# EAGLE design IRAMX-drv-v3 (EAGLE 7.2.0)
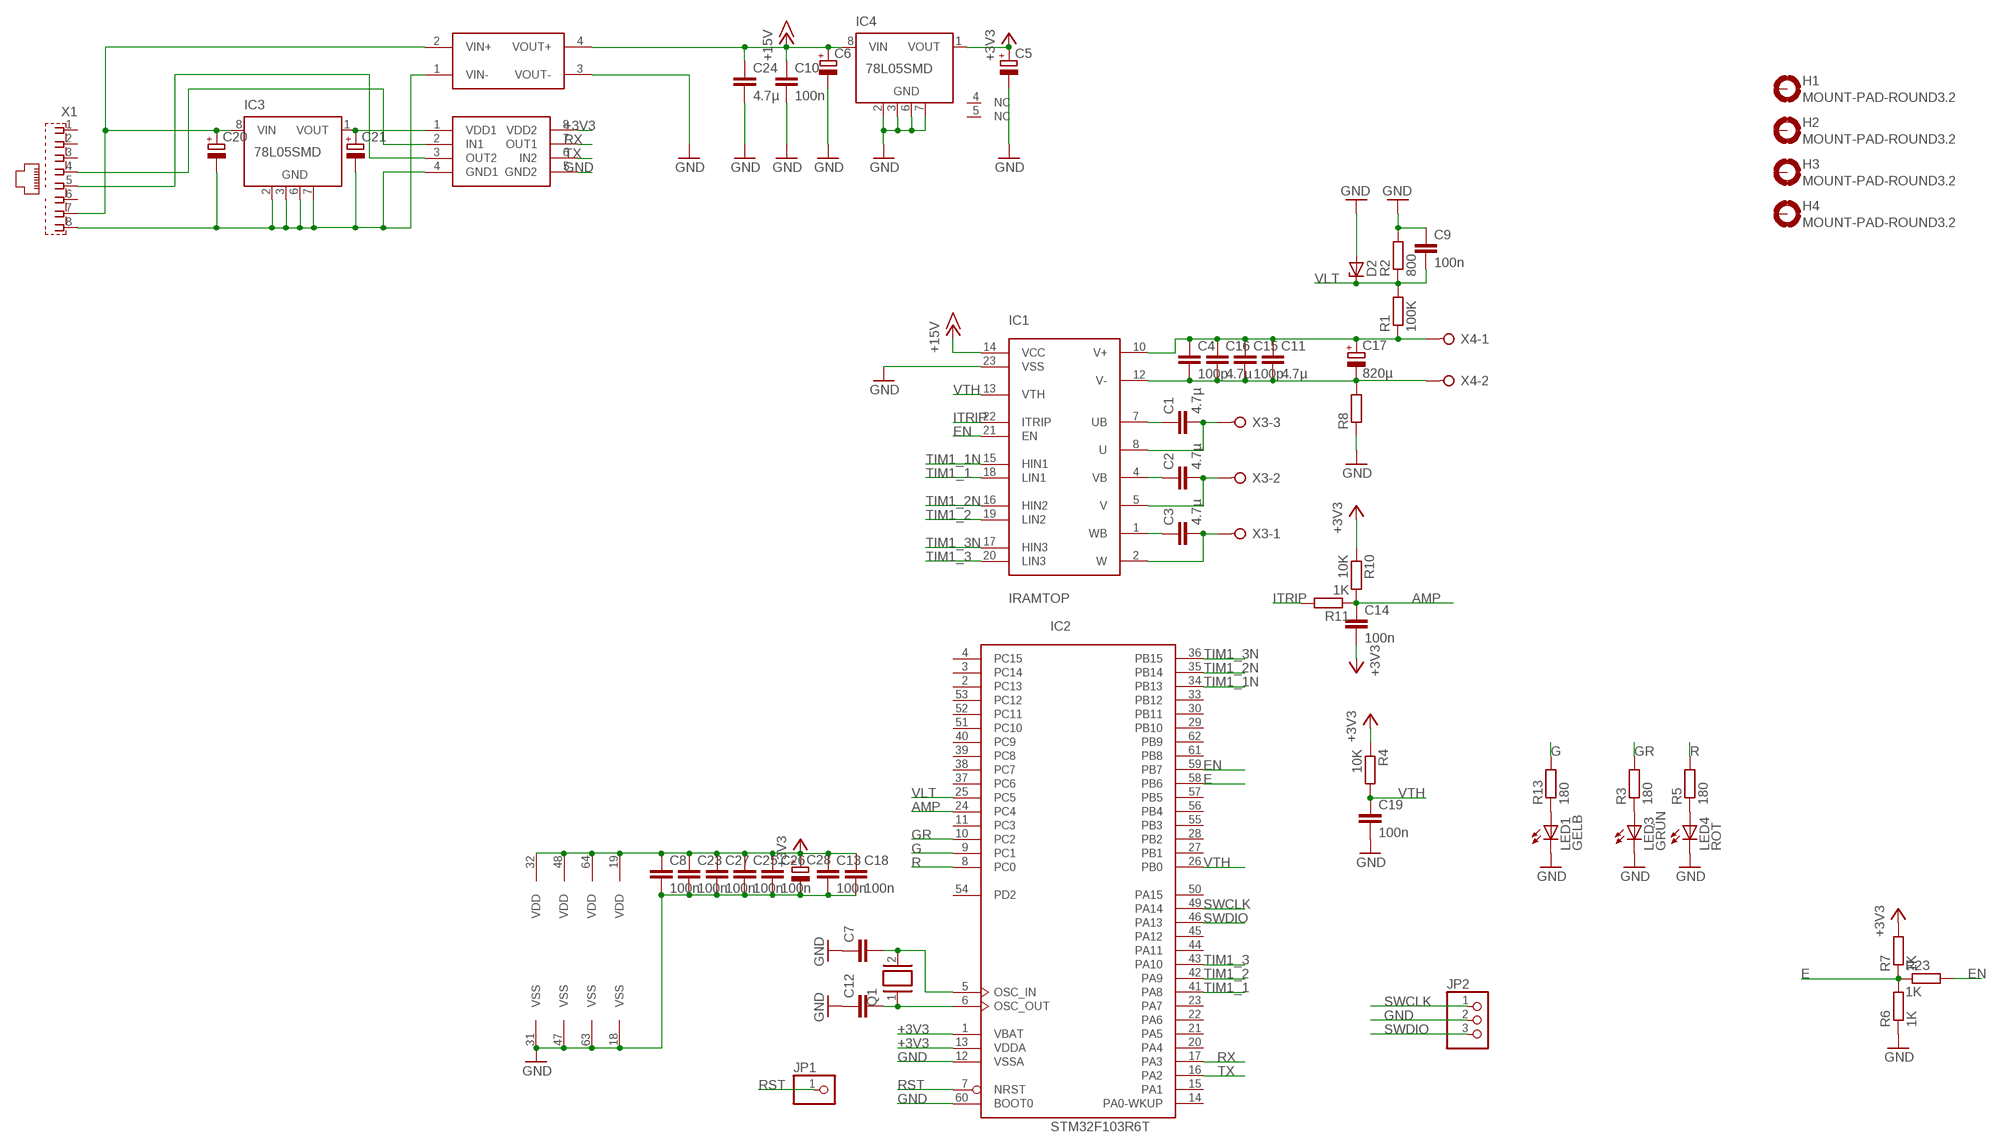
[diagram p0: schematic, sheet 1]

## Parts
C1  4.7µ  C-EUC0805K  [C0805K]
C2  4.7µ  C-EUC0805K  [C0805K]
C3  4.7µ  C-EUC0805K  [C0805K]
C4  100p  C-EUC1206K  [C1206K]
C5  CPOL-EUA/3216-18R  [A/3216-18R]
C6  CPOL-EUA/3216-18R  [A/3216-18R]
C7  C-EUC0805  [C0805]
C8  100n  C-EUC0805K  [C0805K]
C9  100n  C-EUC0805K  [C0805K]
C10  100n  C-EUC0805K  [C0805K]
C11  4.7µ  C-EUC0805K  [C0805K]
C12  C-EUC0805  [C0805]
C13  100n  C-EUC0805K  [C0805K]
C14  100n  C-EUC0805K  [C0805K]
C15  100p  C-EUC1206K  [C1206K]
C16  4.7µ  C-EUC0805K  [C0805K]
C17  820µ  CPOL-EUE10-35  [EB35D]
C18  100n  C-EUC0805K  [C0805K]
C19  100n  C-EUC0805K  [C0805K]
C20  CPOL-EUA/3216-18R  [A/3216-18R]
C21  CPOL-EUA/3216-18R  [A/3216-18R]
C23  100n  C-EUC0805K  [C0805K]
C24  4.7µ  C-EUC0805K  [C0805K]
C25  100n  C-EUC0805K  [C0805K]
C26  100n  C-EUC0805K  [C0805K]
C27  100n  C-EUC0805K  [C0805K]
C28  CPOL-EUA/3216-18R  [A/3216-18R]
D2  ZENER-DIODESOD80C  [SOD80C]
H1  MOUNT-PAD-ROUND3.2  [3,2-PAD]
H2  MOUNT-PAD-ROUND3.2  [3,2-PAD]
H3  MOUNT-PAD-ROUND3.2  [3,2-PAD]
H4  MOUNT-PAD-ROUND3.2  [3,2-PAD]
IC1  IRAMTOP  [SIP23_TOP]
IC2  STM32F103R6T  [LQFP64]
IC3  78L05SMD  [SO08]
IC4  78L05SMD  [SO08]
JP1  PINHD-1X1  [1X01]
JP2  PINHD-1X3  [1X03]
LED1  GELB  LED3MM  [LED3MM]
LED3  GRÜN  LED3MM  [LED3MM]
LED4  ROT  LED3MM  [LED3MM]
Q1  XTAL/S  [QS]
R1  100K  R-EU_R0805  [R0805]
R2  800  R-EU_R0805  [R0805]
R3  180  R-EU_R0805  [R0805]
R4  10K  R-EU_R0805  [R0805]
R5  180  R-EU_R0805  [R0805]
R6  1K  R-EU_R0805  [R0805]
R7  1K  R-EU_R0805  [R0805]
R8  R-EU_R0805  [R0805]
R10  10K  R-EU_R0805  [R0805]
R11  1K  R-EU_R0805  [R0805]
R13  180  R-EU_R0805  [R0805]
R23  1K  R-EU_R0805  [R0805]
U$1  SI8621  [SOIC08]
U$2  RO-XXXX  [SIP4]
X1  RJ45  [RJ45]
X3  W237-03P  [W237-133]
X4  W237-02P  [W237-132]

## Nets
+3V3: C5.+ C8.1 C13.1 C14.2 C18.1 C23.1 C25.1 C26.1 C27.1 C28.+ IC2.1(VBAT) IC2.13(VDDA) IC2.19(VDD) IC2.32(VDD) IC2.48(VDD) IC2.64(VDD) IC4.1(VOUT) R4.1 R7.2 R10.1 U$1.8(VDD2)
+15V: C6.+ C10.1 C24.1 IC1.14(VCC) IC4.8(VIN) U$2.4(VOUT+)
AMP: C14.1 IC2.24(PC4) R10.2 R11.1
E: IC2.58(PB6) R6.2 R7.1 R23.1
EN: IC1.21(EN) IC2.59(PB7) R23.2
G: IC2.9(PC1) R13.2
GND: C5.- C6.- C7.1 C8.2 C9.1 C10.2 C12.1 C13.2 C18.2 C19.2 C23.2 C24.2 C25.2 C26.2 C27.2 C28.- D2.A IC1.23(VSS) IC2.12(VSSA) IC2.18(VSS) IC2.31(VSS) IC2.47(VSS) IC2.60(BOOT0) IC2.63(VSS) IC4.2(GND) IC4.3(GND) IC4.6(GND) IC4.7(GND) JP2.2 LED1.K(C) LED3.K(C) LED4.K(C) R2.2 R6.1 R8.1 U$1.5(GND2) U$2.3(VOUT-)
GR: IC2.10(PC2) R3.2
ISO_GND: C20.- C21.- IC3.2(GND) IC3.3(GND) IC3.6(GND) IC3.7(GND) U$1.4(GND1) U$2.1(VIN-) X1.8
ITRIP: IC1.22(ITRIP) R11.2
N$1 [iso]: C1.1 IC1.7(UB)
N$3 [iso]: C2.1 IC1.4(VB)
N$5 [iso]: C3.1 IC1.1(WB)
N$8: LED3.A R3.1
N$9: LED4.A R5.1
N$10: C7.2 IC2.5(OSC_IN) Q1.2
N$11: C21.+ IC3.1(VOUT) U$1.1(VDD1)
N$12: C12.2 IC2.6(OSC_OUT) Q1.1
N$13: U$1.2(IN1) X1.4
N$14: U$1.3(OUT2) X1.5
N$17: C20.+ IC3.8(VIN) U$2.2(VIN+) X1.7
N$43: LED1.A R13.1
R: IC2.8(PC0) R5.2
RST: IC2.7(NRST) JP1.1
RX: IC2.17(PA3) U$1.7(OUT1)
SWCLK: IC2.49(PA14) JP2.1
SWDIO: IC2.46(PA13) JP2.3
TIM1_1: IC1.18(LIN1) IC2.41(PA8)
TIM1_1N: IC1.15(HIN1) IC2.34(PB13)
TIM1_2: IC1.19(LIN2) IC2.42(PA9)
TIM1_2N: IC1.16(HIN2) IC2.35(PB14)
TIM1_3: IC1.20(LIN3) IC2.43(PA10)
TIM1_3N: IC1.17(HIN3) IC2.36(PB15)
TX: IC2.16(PA2) U$1.6(IN2)
U [dick]: C1.2 IC1.8(U) X3.3
V [dick]: C2.2 IC1.5(V) X3.2
V+ [dick]: C4.1 C11.1 C15.1 C16.1 C17.+ IC1.10(V+) R1.1 X4.1
V-: C4.2 C11.2 C15.2 C16.2 C17.- IC1.12(V-) R8.2 X4.2
VLT: C9.2 D2.C IC2.25(PC5) R1.2 R2.1
VTH: C19.1 IC1.13(VTH) IC2.26(PB0) R4.2
W [dick]: C3.2 IC1.2(W) X3.1
Unconnected: H1.B3,2(MOUNT) H2.B3,2(MOUNT) H3.B3,2(MOUNT) H4.B3,2(MOUNT) IC2.2(PC13) IC2.3(PC14) IC2.4(PC15) IC2.11(PC3) IC2.14(PA0-WKUP) IC2.15(PA1) IC2.20(PA4) IC2.21(PA5) IC2.22(PA6) IC2.23(PA7) IC2.27(PB1) IC2.28(PB2) IC2.29(PB10) IC2.30(PB11) IC2.33(PB12) IC2.37(PC6) IC2.38(PC7) IC2.39(PC8) IC2.40(PC9) IC2.44(PA11) IC2.45(PA12) IC2.50(PA15) IC2.51(PC10) IC2.52(PC11) IC2.53(PC12) IC2.54(PD2) IC2.55(PB3) IC2.56(PB4) IC2.57(PB5) IC2.61(PB8) IC2.62(PB9) IC3.4(NC) IC3.5(NC) IC4.4(NC) IC4.5(NC) X1.1 X1.2 X1.3 X1.6

## Library data of the parts
C1-C4 C7-C16 C18 C19 C23-C27 = rcl:C-EU: CAPACITOR, European symbol
C5 C6 C17 C20 C21 C28 = rcl:CPOL-EU: POLARIZED CAPACITOR, European symbol
D2 = diode:ZENER-DIODE: Z-Diode
H1-H4 = holes:MOUNT-PAD-ROUND: MOUNTING PAD, round
IC1 = iram-b:IRAM
IC2 = micro-stm_v2:STM32F103R*T: ARM 32-bit Cortex™-M3 CPU 72 MHz maximum frequency 16 to 1024 Kbytes of Flash memory 6 to 96 kbytes of SRAM 51 GPIOs 2.0 to 3.6 V application supply
IC3 IC4 = linear:78L*SMD: Positive VOLTAGE REGULATOR
JP1 = pinhead:PINHD-1X1: PIN HEADER
JP2 = pinhead:PINHD-1X3: PIN HEADER
LED1 LED3 LED4 = led:LED: LED OSRAM: - CHIPLED LG R971, LG N971, LY N971, LG Q971, LY Q971, LO R971, LY R971 LH N974, LH R974 LS Q976, LO Q976, LY Q976 LO Q996 - Hyper CHIPLED LW Q18S LB Q993, LB Q99A, LB R99A - SideLED LS A670, LO A670, LY A670, LG A670, LP A670 LB A673, LV A673, LT A673, LW A673 LH A674 LY A675 LS A676, LA A676, LO A676, LY A676, LW A676 LS A679, LY A679, LG A679 - Hyper Micro SIDELED® LS Y876, LA Y876, LO Y876, LY Y876 LT Y87S - SmartLED LW L88C, LW L88S LB L89C, LB L89S, LG L890 LS L89K, LO L89K, LY L89K LS L896, LA L896, LO L896, LY L896 - TOPLED LS T670, LO T670, LY T670, LG T670, LP T670 LSG T670, LSP T670, LSY T670, LOP T670, LYG T670 LG T671, LOG T671, LSG T671 LB T673, LV T673, LT T673, LW T673 LH T674 LS T676, LA T676, LO T676, LY T676, LB T676, LH T676, LSB T676, LW T676 LB T67C, LV T67C, LT T67C, LS T67K, LO T67K, LY T67K, LW E67C LS E67B, LA E67B, LO E67B, LY E67B, LB E67C, LV E67C, LT E67C LW T67C LS T679, LY T679, LG T679 LS T770, LO T770, LY T770, LG T770, LP T770 LB T773, LV T773, LT T773, LW T773 LH T774 LS E675, LA E675, LY E675, LS T675 LS T776, LA T776, LO T776, LY T776, LB T776 LHGB T686 LT T68C, LB T68C - Hyper Mini TOPLED® LB M676 - Mini TOPLED Santana® LG M470 LS M47K, LO M47K, LY M47K Source: http://www.osram.convergy.de LUXEON: - LUMILED® LXK2-PW12-R00, LXK2-PW12-S00, LXK2-PW14-U00, LXK2-PW14-V00 LXK2-PM12-R00, LXK2-PM12-S00, LXK2-PM14-U00 LXK2-PE12-Q00, LXK2-PE12-R00, LXK2-PE12-S00, LXK2-PE14-T00, LXK2-PE14-U00 LXK2-PB12-K00, LXK2-PB12-L00, LXK2-PB12-M00, LXK2-PB14-N00, LXK2-PB14-P00, LXK2-PB14-Q00 LXK2-PR12-L00, LXK2-PR12-M00, LXK2-PR14-Q00, LXK2-PR14-R00 LXK2-PD12-Q00, LXK2-PD12-R00, LXK2-PD12-S00 LXK2-PH12-R00, LXK2-PH12-S00 LXK2-PL12-P00, LXK2-PL12-Q00, LXK2-PL12-R00 Source: www.luxeon.com KINGBRIGHT: KA-3528ASYC Source: www.kingbright.com
Q1 = special:XTAL/S: CRYSTAL
R1-R8 R10 R11 R13 R23 = rcl:R-EU_: RESISTOR, European symbol
U$1 = reroolib:SI8621
U$2 = reroolib:RO-XXXX
X1 = reroolib:RJ45: AMP connector
X3 = con-wago-508:W237-03P: WAGO SREW CLAMP; OC_FARNELL: unknown; OC_NEWARK: unknown
X4 = con-wago-508:W237-02P: WAGO SREW CLAMP; OC_FARNELL: unknown; OC_NEWARK: unknown

## Net classes
0 default: width 0.3 mm, clearance 0.19 mm
1 dick: width 3.5 mm, clearance 0.5 mm
2 iso: width 0.5 mm, clearance 0.5 mm

## Board
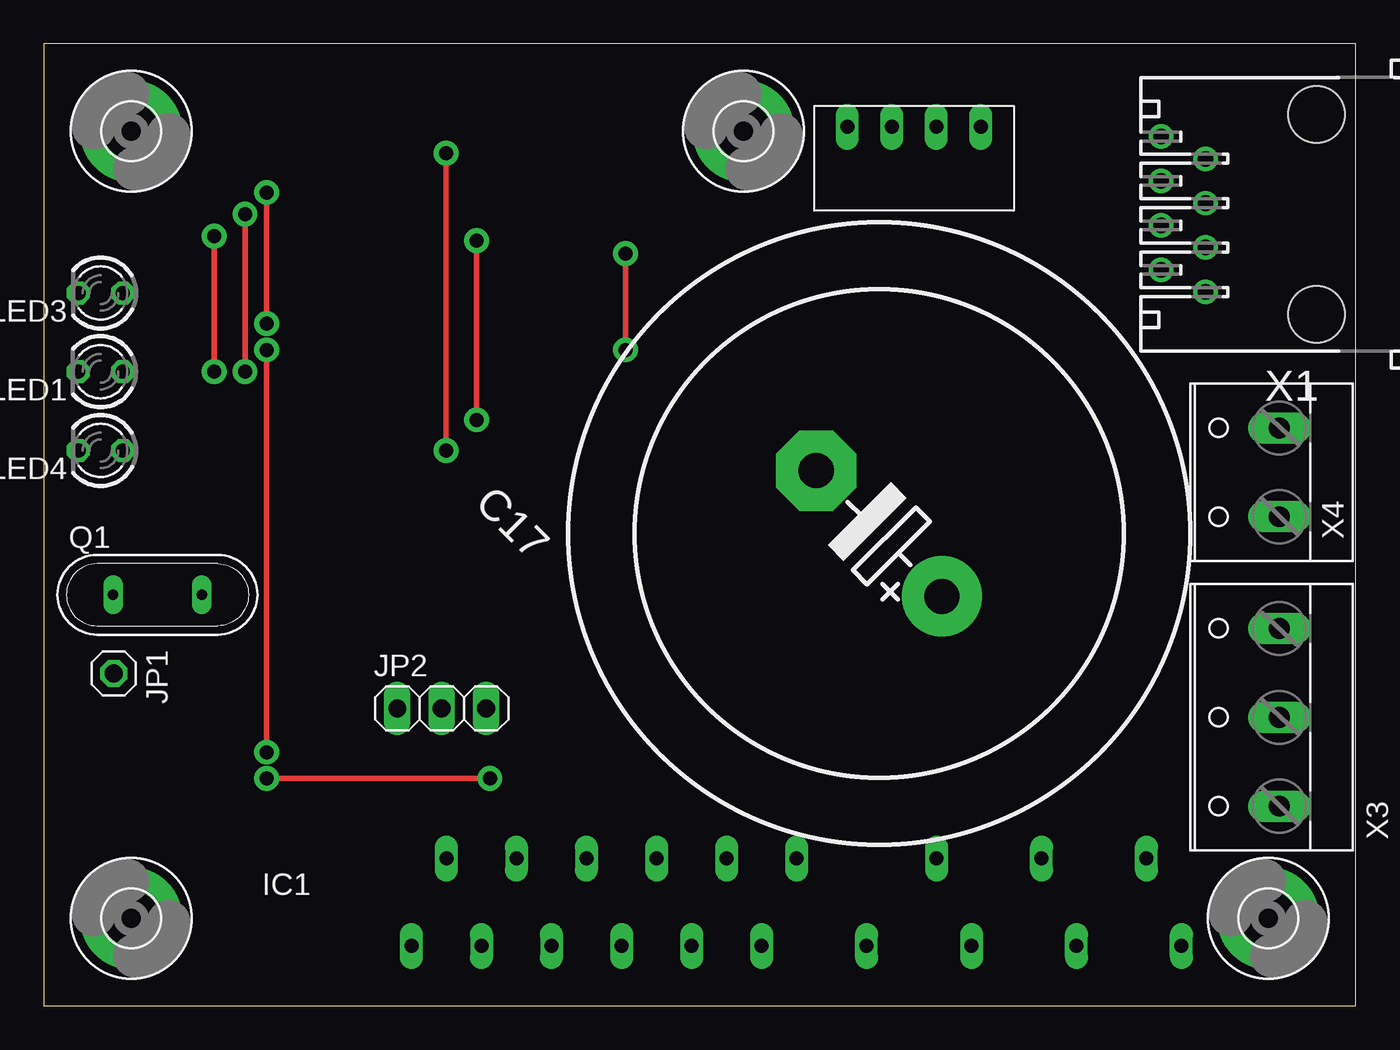
[diagram p1: board, top side]
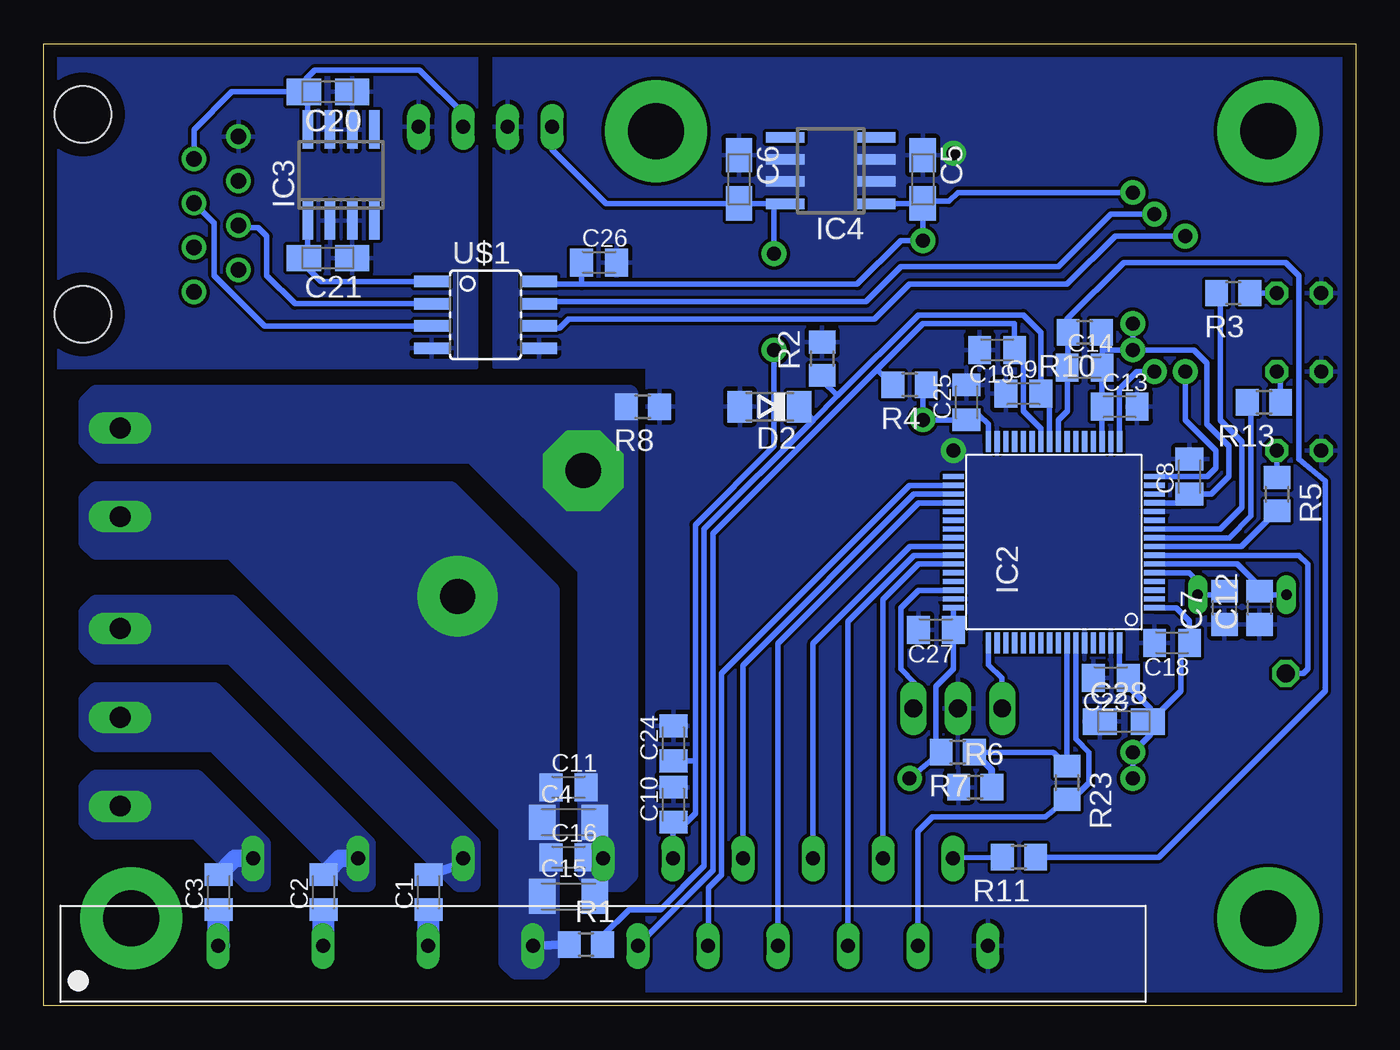
[diagram p2: board, bottom side, seen from below]

Size 75 x 55 mm. Coordinates in mm from the lower left corner, seen from the top.
Outline: 0,55 0,0 75,0 75,55 0,55
Copper layers (1*16): Top 0.035mm / dielectric 1.5mm / Bottom 0.035mm
Design rules "cnc": minimum track width 10mil, minimum drill 0.1mm, track to track 7mil, track to pad 7mil, pad to pad 7mil, via to via 7mil, smd to smd 7mil, copper to edge 30mil, drill to drill 8mil, minimum pad ring 10mil, minimum via ring 8mil, stop-mask expansion 4mil, vias tented up to drill 0mil, thermal gap 10mil

### Footprints (pad centres in the part's own frame; a part is rotated, then mirrored left to right if it is on the bottom)
C0805K = smd 1.3 x 1.6: 1 -1,0; 2 1,0
C1206K = smd 1.5 x 2: 1 -1.5,0; 2 1.5,0
A/3216-18R = smd 1.95 x 1.5: + 1.375,0; - -1.375,0
C0805 = smd 1.3 x 1.5: 1 -0.95,0; 2 0.95,0
EB35D = drill 2.007 pad 4.597: + -5.08,0 | drill 2.007 pad 4.597 octagon: - 5.08,0
SOD80C = smd 1.4 x 1.8: A 1.7,0; C -1.7,0
3,2-PAD = drill 3.2 pad 5.842: B3,2 0,0
SIP23_TOP = drill 0.8 long: 1 2.03,-5.08; 2 0.03,-0.08; 4 -3.97,-5.08; 5 -5.97,-0.08; 7 -9.97,-5.08; 8 -11.97,-0.08; 10 -15.97,-5.08; 12 -19.97,-0.08; 13 -21.97,-5.08; 14 -23.97,-0.08; 15 -25.97,-5.08; 16 -27.97,-0.08; 17 -29.97,-5.08; 18 -31.97,-0.08; 19 -33.97,-5.08; 20 -35.97,-0.08; 21 -37.97,-5.08; 22 -39.97,-0.08; 23 -41.97,-5.08
LQFP64 = smd 0.3 x 1.2: 1 -3.75,-5.75; 2 -3.25,-5.75; 3 -2.75,-5.75; 4 -2.25,-5.75; 5 -1.75,-5.75; 6 -1.25,-5.75; 7 -0.75,-5.75; 8 -0.25,-5.75; 9 0.25,-5.75; 10 0.75,-5.75; 11 1.25,-5.75; 12 1.75,-5.75; 13 2.25,-5.75; 14 2.75,-5.75; 15 3.25,-5.75; 16 3.75,-5.75; 33 3.75,5.75; 34 3.25,5.75; 35 2.75,5.75; 36 2.25,5.75; 37 1.75,5.75; 38 1.25,5.75; 39 0.75,5.75; 40 0.25,5.75; 41 -0.25,5.75; 42 -0.75,5.75; 43 -1.25,5.75; 44 -1.75,5.75; 45 -2.25,5.75; 46 -2.75,5.75; 47 -3.25,5.75; 48 -3.75,5.75 | smd 1.2 x 0.3: 17 5.75,-3.75; 18 5.75,-3.25; 19 5.75,-2.75; 20 5.75,-2.25; 21 5.75,-1.75; 22 5.75,-1.25; 23 5.75,-0.75; 24 5.75,-0.25; 25 5.75,0.25; 26 5.75,0.75; 27 5.75,1.25; 28 5.75,1.75; 29 5.75,2.25; 30 5.75,2.75; 31 5.75,3.25; 32 5.75,3.75; 49 -5.75,3.75; 50 -5.75,3.25; 51 -5.75,2.75; 52 -5.75,2.25; 53 -5.75,1.75; 54 -5.75,1.25; 55 -5.75,0.75; 56 -5.75,0.25; 57 -5.75,-0.25; 58 -5.75,-0.75; 59 -5.75,-1.25; 60 -5.75,-1.75; 61 -5.75,-2.25; 62 -5.75,-2.75; 63 -5.75,-3.25; 64 -5.75,-3.75
SO08 = smd 0.6 x 2.2: 1 -1.905,-2.6; 2 -0.635,-2.6; 3 0.635,-2.6; 4 1.905,-2.6; 5 1.905,2.6; 6 0.635,2.6; 7 -0.635,2.6; 8 -1.905,2.6
1X01 = drill 1.016 octagon: 1 0,0
1X03 = drill 1.016 long: 1 -2.54,0; 2 0,0; 3 2.54,0
LED3MM = drill 0.813 octagon: A -1.27,0; K 1.27,0
QS = drill 0.61 long: 1 -2.54,0; 2 2.54,0
R0805 = smd 1.3 x 1.5: 1 -0.95,0; 2 0.95,0
SOIC08 = smd 0.66 x 2.032: 1 -1.905,-3.073; 2 -0.635,-3.073; 3 0.635,-3.073; 4 1.905,-3.073; 5 1.905,3.073; 6 0.635,3.073; 7 -0.635,3.073; 8 -1.905,3.073
SIP4 = drill 0.8 long: 1 3.81,0; 2 1.27,0; 3 -1.27,0; 4 -3.81,0
RJ45 = drill 0.889: 1 -4.445,6.35; 2 -3.175,8.89; 3 -1.905,6.35; 4 -0.635,8.89; 5 0.635,6.35; 6 1.905,8.89; 7 3.175,6.35; 8 4.445,8.89 | hole 3.251: -5.715,0; 5.715,0
W237-133 = drill 1.194 long: 1 -5.08,-0.635; 2 0,-0.635; 3 5.08,-0.635
W237-132 = drill 1.194 long: 1 -2.54,-0.635; 2 2.54,-0.635

### Placement (x,y rotation side)
C1  53,6.5 90 bottom
C2  59.01,6.5 90 bottom
C3  65,6.5 90 bottom
C4  45,10.49 0 bottom
C5  24.75,47.25 270 bottom
C6  35.25,47.25 270 bottom
C7  7.5,22.75 90 bottom
C8  9.5,30.25 90 bottom
C9  19,35 0 bottom
C10  39,11.5 90 bottom
C11  45,12.49 0 bottom
C12  5.5,22.75 90 bottom
C13  13.5,34.25 0 bottom
C14  15.5,36.5 0 bottom
C15  45,6.25 0 bottom
C16  45,8.49 0 bottom
C17  47.75,27 135 top
C18  10.5,20.75 180 bottom
C19  20.5,37.5 180 bottom
C20  58.75,52.25 180 bottom
C21  58.75,42.75 180 bottom
C23  14,18.75 180 bottom
C24  39,15 90 bottom
C25  22.25,34.5 90 bottom
C26  43.25,42.5 0 bottom
C27  24,21.5 180 bottom
C28  13.25,16.25 0 bottom
D2  33.5,34.25 180 bottom
H1  70,5 270 top
H2  5,5 270 top
H3  5,50 270 top
H4  40,50 270 top
IC1  63,8.51 0 top
IC2  17.25,26.51 90 bottom
IC3  58,47.5 0 bottom
IC4  30,47.75 90 bottom
JP1  4,19 270 top
JP2  22.75,17 0 top
LED1  3.25,36.25 180 top
LED3  3.25,40.75 180 top
LED4  3.25,31.75 180 top
Q1  6.5,23.5 0 top
R1  44,3.5 0 bottom
R2  30.5,37 90 bottom
R3  7,40.75 180 bottom
R4  25.5,35.5 180 bottom
R5  4.5,29.25 270 bottom
R6  21.75,12.5 0 bottom
R7  22.75,14.5 180 bottom
R8  40.75,34.25 180 bottom
R10  15.49,38.5 180 bottom
R11  19.25,8.5 180 bottom
R13  5.25,34.5 180 bottom
R23  16.5,12.75 270 bottom
U$1  49.75,39.5 270 bottom
U$2  49.75,50.25 0 top
X1  72.75,45.25 90 top
X3  70,16.5 90 top
X4  70,30.5 90 top

### Tracks (layer width: path | path; a pad name or v marks a point on that pad's centre or on a via)
+3V3  (via drill 0.8 pad 1.42)
  Top 0.3: v12.75,37.5 v12.75,14.5 | v25.5,13 v12.75,13 | v24.75,43.75 v24.75,33.5 | v12.75,39 v12.75,46.5
  Bottom 0.3: R10.1 14.5,38.45 14.5,37.5 | IC2.1 10.26,22.76 9.5,22 C18.1 9.69,20.75 9.6,20.66 | IC2.64 13.5,19.25 C23.1 13,18.25 11.75,17 11.75,16.62 C28.+ 11.75,16.25 | 14.5,37.5 v12.75,37.5 | IC2.48 C27.1 23,19.25 24,18.25 24,14.3 R7.2 v25.5,13 | v12.75,13 v12.75,14.5 11.75,15.5 11.75,16.25 | 11.75,16.25 10,18 10,20 9.6,20.66 | 9.6,20.66 9.25,21.25 | v12.75,37.5 9.25,37.5 8.5,36.75 8.5,33.25 7.25,32 7.25,30.25 8.25,29.25 C8.1 10,28.76 10.26,28.76 | IC4.1 24.78,45.84 C5.+ | C5.+ v24.75,43.75 26,43.75 28.5,41.25 44.25,41.25 | R4.1 24.75,34.7 v24.75,33.5 C25.1 22,33.75 21.5,33.75 21,33.25 IC2.32 | v12.75,37.5 v12.75,39 | v12.75,46.5 22.75,46.5 23.25,46 24.62,46 C5.+ | 14.5,37.5 C14.2 14.5,36.75 C13.1 IC2.19 | 44.25,41.25 46.52,41.25 U$1.8 | C26.1 44.25,41.25 | IC2.13 10.26,28.76 | 10.26,28.76 10.25,28.75
  Bottom 0.406: 14.5,34.5 C13.1
+15V  (via drill 0.8 pad 1.42)
  Top 0.3: v33.25,43 v33.25,37.5
  Bottom 0.3: 35.5,45.84 42.84,45.84 45.94,48.94 U$2.4 | 35.5,45.84 IC4.8 33.25,45.74 v33.25,43 | C6.+ 35.47,45.88 35.5,45.84 | v33.25,37.5 33.25,32 37.75,27.5 37.75,14 | 39.03,8.47 IC1.14 39.03,10.47 C10.1 38.25,10.5 37.75,11 37.75,14 | C24.1 37.75,14
AMP
  Bottom 0.3: R11.1 11.25,8.5 1.75,18 1.75,30 3.25,31.25 3.25,41.75 4,42.5 13.25,42.5 16.5,39.25 16.5,38.55 R10.2 16.45,36.8 C14.1 16.5,34 17,33.5 IC2.24
E
  Bottom 0.3: IC2.58 16.5,13.96 R23.1 17.25,14.45 17.3,14.5 R7.1
  Bottom 0.406: R6.2 20.8,13.5 R7.1
EN
  Bottom 0.3: IC1.21 25.03,9.97 24.2,10.8 17.75,10.8 R23.2 16.45,12 16,12 15.25,12.75 15.25,14.5 16,15.25 IC2.59
G
  Bottom 0.3: IC2.9 7.24,26.76 6,28 6,34.05 R13.2
GND  (via drill 0.8 pad 1.42)
  Top 0.3: v23,31.75 v23,48.75
  pour Bottom: 49.25,54.81 49.25,36.51 40.5,36.5 40.5,0.25 40.68,0.17 0,-0.01 0,55.03
  pour Bottom (no thermals): 26,49 34,49 34,46.5 26,46.5
GR
  Bottom 0.3: IC2.10 7.74,27.26 6.5,28.5 6.5,32.25 7.75,33.5 7.75,40.2 R3.2
ISO_GND
  pour Bottom: 75,55 75,36.5 50.25,36.5 50.25,55
ITRIP
  Bottom 0.3: R11.2 23,8.45 IC1.22
N$1
  Bottom 1.25: IC1.7 53,3.45 C1.1
N$3
  Bottom 1.25: IC1.4 59.01,3.45 C2.1
N$5
  Bottom 1.25: IC1.1 65,3.46 C3.1
N$8
  Bottom 0.3: R3.1 LED3.A
N$9
  Bottom 0.3: R5.1 4.5,31.73 LED4.A
N$10
  Bottom 0.3: C7.2 7.7,23.5 Q1.2 9.04,24.29 9.51,24.76 IC2.5
N$11
  Bottom 0.3: IC3.1 59.91,42.75 C21.+ 60,42.62 60,42.25 59.16,41.41 U$1.1
N$12
  Bottom 0.3: Q1.1 5.3,23.5 C12.2 5.5,24 6.76,25.26 IC2.6
N$13
  Bottom 0.3: X1.4 63.74,44.5 62.75,44.5 62.25,44 62.25,41.75 60.63,40.13 U$1.2
N$14
  Bottom 0.3: X1.5 65.25,44.73 65.25,41.75 62.37,38.87 U$1.3
N$17
  Bottom 0.3: C20.+ 59.91,52.25 IC3.8 59.91,52 | C20.+ 60,52.38 60,53 59.5,53.5 53.5,53.5 51,51 51,50.27 U$2.2 | X1.7 66.4,50.1 64.25,52.25 C20.+
N$43
  Bottom 0.3: R13.1 4.32,35.95 LED1.A
R
  Bottom 0.3: IC2.8 6.54,26.26 R5.2
RST
  Bottom 0.3: IC2.7 3.26,25.76 2.75,25.25 2.75,19.25 3,19 JP1.1
RX  (via drill 0.8 pad 1.42)
  Top 0.3: v11.5,36.25 v11.5,45.25
  Bottom 0.3: v11.5,36.25 12.5,36.25 13.5,35.25 IC2.17 | v11.5,45.25 14,45.25 17,42.25 26,42.25 28,40.25 46.56,40.25 U$1.7
SWCLK
  Bottom 0.3: JP2.1 20.21,17.98 20.23,18.75 21,19.5 IC2.49
SWDIO
  Bottom 0.3: IC2.46 24.99,23.76 26,22.75 26,19.25 25.25,18.5 25.25,17.29 JP2.3
TIM1_1
  Bottom 0.3: IC1.18 31.03,20.72 25.49,26.26 IC2.41
TIM1_1N
  Bottom 0.3: IC1.15 37,3.45 37,6.75 36.25,7.5 36.25,19 25.5,29.75 IC2.34
TIM1_2
  Bottom 0.3: IC1.19 29.03,21.97 25.24,25.76 IC2.42
TIM1_2N
  Bottom 0.3: IC1.16 35.03,19.47 25.25,29.25 IC2.35
TIM1_3
  Bottom 0.3: IC1.20 27.03,23.22 24.99,25.26 IC2.43
TIM1_3N
  Bottom 0.3: IC1.17 33.03,20.72 25,28.75 IC2.36
TX  (via drill 0.8 pad 1.42)
  Top 0.3: v9.75,36.25 v9.75,44
  Bottom 0.3: v9.75,36.25 9.75,33.5 8,31.75 8,30.75 8.49,30.26 IC2.16 | v9.75,44 13.75,44 16.5,41.25 25.5,41.25 27.5,39.25 45,39.25 45.5,38.75 46.56,38.75 U$1.6
U
  Bottom 0.5: C1.2 51.45,8 IC1.8
  pour Bottom (no thermals): 72,23 72.5,22.5 72.5,20.5 72,20 64.25,20 51.25,7 50.5,7 50.5,9.25 64.25,23
V
  Bottom 1: C2.2 58.75,7.75 58.08,8.43 IC1.5
  pour Bottom (no thermals): 72,18 72.5,17.5 72.5,15.5 72,15 65.25,15 57.25,7 56.5,7 56.5,9.25 65.25,18
V+
  Bottom 0.5: R1.1 IC1.10
  pour Bottom (no thermals): 72,29.5 51.75,29.5 46,23.75 46,2.5 46.5,2 48,2 48.5,2.5 48.5,10.25 64.25,26 72,26 72.5,26.5 72.5,29
V-
  pour Bottom (no thermals): 72,35 72.5,34.5 72.5,32.25 71.75,31.5 50.5,31.5 44,25 44,7.5 43.5,7 42,7 41.5,7.5 41.5,35
VLT
  Bottom 0.3: 31,33.5 29.62,34.88 | 29.62,34.88 25,39.5 19,39.5 18,38.5 C9.2 17.5,34.5 IC2.25 | 31,33.5 37.25,27.25 37.25,8 39.75,5.5 41.55,5.5 43.05,4 R1.2 | D2.C 31.75,34.25 31,33.5 | R2.1 30.5,35.75 29.62,34.88
VTH
  Bottom 0.3: 27.38,36.38 24.75,39 19.5,39 C19.1 19,37 19,34 18,33 IC2.26 | R4.2 26.5,35.5 27.38,36.38 | 27.38,36.38 36.75,27 36.75,7.75 41.03,3.47 IC1.13
W
  Bottom 1: C3.2 64.07,8.43 IC1.2
  pour Bottom (no thermals): 72,13 72.5,12.5 72.5,10.5 72,10 66.25,10 63.25,7 62.5,7 62.5,9.25 66.25,13